# Altium schematic sheet 2_MCU.schdoc.schdoc
size 431 x 309 mm; Symbol: Sheet-Symbol_A4; Device: Sheet-Symbol_A4; @Page Name: MCU; @Create Date: 2023-11-05; @Page Count: 4; @Page No: 4; @Project Name: New Project_2023-10-25_23-03-02; @Schematic Name: Schematic1; @Update Date: 2023-12-01; Company: 嘉立创EDA; Page Size: A4; Version: V1.0; SheetNumber: 4; SheetTotal: 4
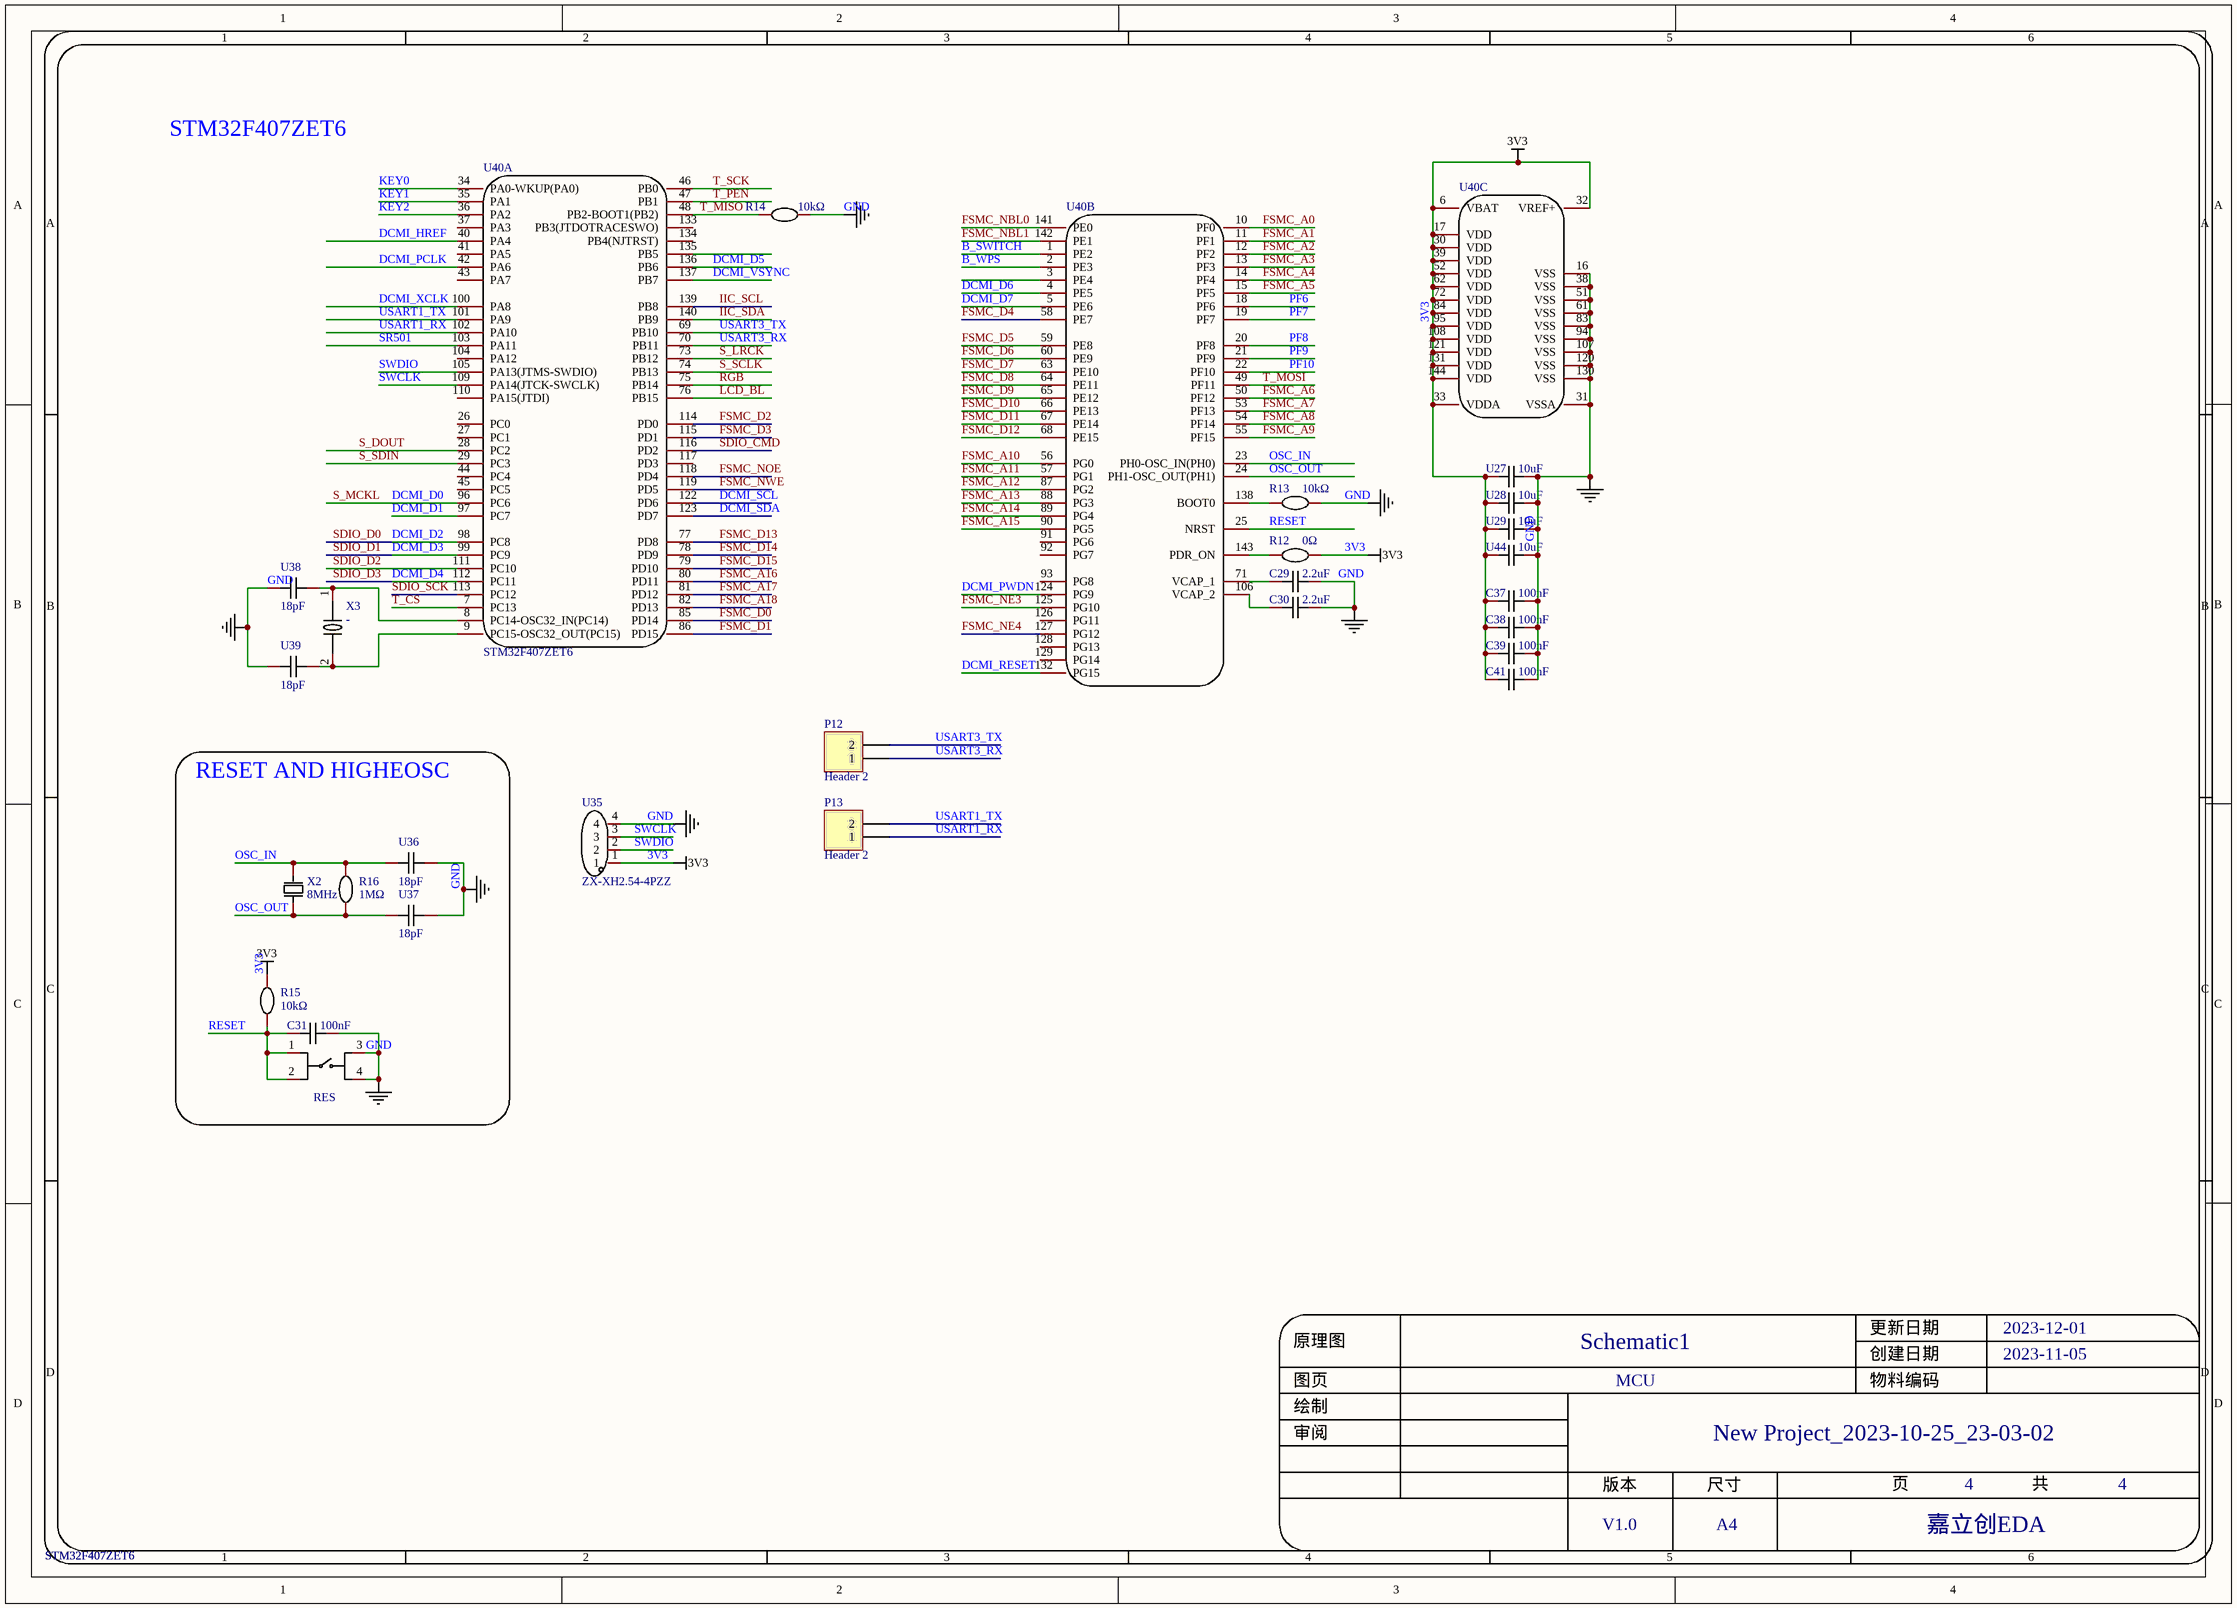
[diagram p0: 2_MCU.schdoc.schdoc]

## Parts
C29  2.2uF  [C0603]
C30  2.2uF  [C0603]
C31  100nF  [C0603]
C37  100nF  [C0603]
C38  100nF  [C0603]
C39  100nF  [C0603]
C41  100nF  [C0603]
P12  Header 2  [HDR1X2]
P13  Header 2  [HDR1X2]
R12  0Ω  [R0603]
R13  10kΩ  [R0603]
R14  10kΩ  [R0603]
R15  10kΩ  [R0603]
R16  1MΩ  [R0603]
RES  K2-6639SP-C4SC-04  [KEY-SMD_4P-L6.0-W6.0-P3.90-LS10.0]  (value not drawn)
U27  10uF  [C0603]
U28  10uF  [C0603]
U29  10uF  [C0603]
U35  ZX-XH2.54-4PZZ  [CONN-TH_4P-P2.50_4PIN]
U36  18pF  [C0603]
U37  18pF  [C0603]
U38  18pF  [C0603]
U39  18pF  [C0603]
U40  STM32F407ZET6  [LQFP-144_L20.0-W20.0-P0.50-LS22.0-BL]  (parts A,B,C of 3)
U44  10uF  [C0603]
X2  8MHz  [OSC-SMD_L5.0-W3.2]
X3  -  [OSC-SMD_2P-L1.6-W1.0]

## Blocks framed on the sheet
RESET AND HIGHEOSC: C31 R15 R16 RES U36 U37 X2

## Nets
3V3: C37.1 C38.1 C39.1 C41.1 R12.2 R15.2 U27.1 U28.1 U29.1 U35.1 U40.6(VBAT) U40.17(VDD) U40.30(VDD) U40.32(VREF+) U40.33(VDDA) U40.39(VDD) U40.52(VDD) U40.62(VDD) U40.72(VDD) U40.84(VDD) U40.95(VDD) U40.108(VDD) U40.121(VDD) U40.131(VDD) U40.144(VDD) U44.1
GND: C29.2 C30.2 C31.2 C37.2 C38.2 C39.2 C41.2 R13.2 R14.2 RES.3 RES.4 U27.2 U28.2 U29.2 U35.4 U36.2 U37.2 U38.1 U39.1 U40.16(VSS) U40.31(VSSA) U40.38(VSS) U40.51(VSS) U40.61(VSS) U40.83(VSS) U40.94(VSS) U40.107(VSS) U40.120(VSS) U40.130(VSS) U44.2
B_SWITCH: U40.1(PE2)
B_WPS: U40.2(PE3)
DCMI_D0: U40.96(PC6)  [also labelled S_MCKL]
DCMI_D1: U40.97(PC7)
DCMI_D2: U40.98(PC8)  [also labelled SDIO_D0]
DCMI_D3: U40.99(PC9)  [also labelled SDIO_D1]
DCMI_D4: U40.112(PC11)  [also labelled SDIO_D3]
DCMI_D5: U40.136(PB6)
DCMI_D6: U40.4(PE5)
DCMI_D7: U40.5(PE6)
DCMI_HREF: U40.40(PA4)
DCMI_PCLK: U40.42(PA6)
DCMI_PWDN: U40.124(PG9)
DCMI_RESET: U40.132(PG15)
DCMI_SCL: U40.122(PD6)
DCMI_SDA: U40.123(PD7)
DCMI_VSYNC: U40.137(PB7)
DCMI_XCLK: U40.100(PA8)
FSMC_A0: U40.10(PF0)
FSMC_A1: U40.11(PF1)
FSMC_A2: U40.12(PF2)
FSMC_A3: U40.13(PF3)
FSMC_A4: U40.14(PF4)
FSMC_A5: U40.15(PF5)
FSMC_A6: U40.50(PF12)
FSMC_A7: U40.53(PF13)
FSMC_A8: U40.54(PF14)
FSMC_A9: U40.55(PF15)
FSMC_A10: U40.56(PG0)
FSMC_A11: U40.57(PG1)
FSMC_A12: U40.87(PG2)
FSMC_A13: U40.88(PG3)
FSMC_A14: U40.89(PG4)
FSMC_A15: U40.90(PG5)
FSMC_A16: U40.80(PD11)
FSMC_A17: U40.81(PD12)
FSMC_A18: U40.82(PD13)
FSMC_D0: U40.85(PD14)
FSMC_D1: U40.86(PD15)
FSMC_D2: U40.114(PD0)
FSMC_D3: U40.115(PD1)
FSMC_D4: U40.58(PE7)
FSMC_D5: U40.59(PE8)
FSMC_D6: U40.60(PE9)
FSMC_D7: U40.63(PE10)
FSMC_D8: U40.64(PE11)
FSMC_D9: U40.65(PE12)
FSMC_D10: U40.66(PE13)
FSMC_D11: U40.67(PE14)
FSMC_D12: U40.68(PE15)
FSMC_D13: U40.77(PD8)
FSMC_D14: U40.78(PD9)
FSMC_D15: U40.79(PD10)
FSMC_NBL0: U40.141(PE0)
FSMC_NBL1: U40.142(PE1)
FSMC_NE3: U40.125(PG10)
FSMC_NE4: U40.127(PG12)
FSMC_NOE: U40.118(PD4)
FSMC_NWE: U40.119(PD5)
IIC_SCL: U40.139(PB8)
IIC_SDA: U40.140(PB9)
KEY0: U40.34(PA0-WKUP(PA0))
KEY1: U40.35(PA1)
KEY2: U40.36(PA2)
LCD_BL: U40.76(PB15)
OSC_IN: R16.2 U36.1 U40.23(PH0-OSC_IN(PH0)) X2.2(OSC2)
OSC_OUT: R16.1 U37.1 U40.24(PH1-OSC_OUT(PH1)) X2.1(OSC1)
PF6: U40.18(PF6)
PF7: U40.19(PF7)
PF8: U40.20(PF8)
PF9: U40.21(PF9)
PF10: U40.22(PF10)
RESET: C31.1 R15.1 RES.1 RES.2 U40.25(NRST)
RGB: U40.75(PB14)
S_DOUT: U40.28(PC2)
S_LRCK: U40.73(PB12)
S_SCLK: U40.74(PB13)
S_SDIN: U40.29(PC3)
SDIO_CMD: U40.116(PD2)
SDIO_D2: U40.111(PC10)
SDIO_SCK: U40.113(PC12)
SR501: U40.103(PA11)
SWCLK: U35.3 U40.109(PA14(JTCK-SWCLK))
SWDIO: U35.2 U40.105(PA13(JTMS-SWDIO))
T_CS: U40.7(PC13)
T_MISO: R14.1 U40.48(PB2-BOOT1(PB2))
T_MOSI: U40.49(PF11)
T_PEN: U40.47(PB1)
T_SCK: U40.46(PB0)
USART1_RX: P13.1 U40.102(PA10)
USART1_TX: P13.2 U40.101(PA9)
USART3_RX: P12.1 U40.70(PB11)
USART3_TX: P12.2 U40.69(PB10)
NetC29_1: C29.1 U40.71(VCAP_1)
NetC30_1: C30.1 U40.106(VCAP_2)
NetR12_1: R12.1 U40.143(PDR_ON)
NetR13_1: R13.1 U40.138(BOOT0)
NetU38_2: U38.2 U40.8(PC14-OSC32_IN(PC14)) X3.1
NetU39_2: U39.2 U40.9(PC15-OSC32_OUT(PC15)) X3.2

Not connected (* = marked no-connect by the designer): U40 3(PE4) 26(PC0) 27(PC1) 37(PA3) 41(PA5) 43(PA7) 44(PC4) 45(PC5) 91(PG6) 92(PG7) 93(PG8) 104(PA12) 110(PA15(JTDI)) 117(PD3) 126(PG11) 128(PG13) 129(PG14) 133(PB3(JTDOTRACESWO)) 134(PB4(NJTRST)) 135(PB5)

## Notes on the sheet
- STM32F407ZET6
- 1
- 2
- 3
- 4
- 5
- 6
- A
- B
- C
- D
- 原理图
- Schematic1
- 创建日期
- 更新日期
- 2023-11-05
- 2023-12-01
- 审阅
- 绘制
- 图页
- MCU
- 物料编码
- New Project_2023-10-25_23-03-02
- 版本
- 尺寸
- 页
- 共
- V1.0
- A4
- 嘉立创EDA

## Library data of the parts
C29 C30 = C1608X6S1A225K080AB: 容值:2.2uF;精度:±10%;额定电压:10V;材质(温度系数):X6S;; Manufacturer: TDK; Add into BOM: yes; Tolerance: ±10%; Voltage Rated: 10V; Temperature Coefficient: X6S; Name: 2.2uF; Symbol: C1608X6S1A225K080AB; Device: C1608X6S1A225K080AB; LCSC Part Name: 2.2uF ±10% 10V; Supplier Part: C3888161; Manufacturer Part: C1608X6S1A225K080AB; Supplier Footprint: 0603; Supplier: LCSC; Convert to PCB: yes; Value: 2.2uF
C31 C37-C39 C41 = CGA3E3X8R1H104M080AE: 容值:100nF;精度:±20%;额定电压:50V;材质(温度系数):X8R;; Manufacturer: TDK; Add into BOM: yes; Tolerance: ±20%; Voltage Rated: 50V; Temperature Coefficient: X8R; Name: 100nF; Symbol: CGA3E3X8R1H104M080AE; Device: CGA3E3X8R1H104M080AE; LCSC Part Name: 100nF ±20% 50V; Supplier Part: C3855738; Manufacturer Part: CGA3E3X8R1H104M080AE; Supplier Footprint: 0603; Supplier: LCSC; Convert to PCB: yes; Value: 100nF
P12 P13 = Header 2: Header, 2-Pin; LatestRevisionDate: 17-Jul-2002; LatestRevisionNote: Re-released for DXP Platform.; Publisher: Altium Limited
R12 = RC0603JR-130RL: 电阻类型:厚膜电阻;阻值:0Ω;精度:-;功率:100mW;; Manufacturer: YAGEO(国巨); Add into BOM: yes; Power(Watts): 100mW; Overload Voltage (Max): 75V; Name: 0Ω; Symbol: RC0603JR-130RL; Device: RC0603JR-130RL; LCSC Part Name: 0Ω 100mW; Supplier Part: C1512169; Manufacturer Part: RC0603JR-130RL; Supplier Footprint: 0603; JLCPCB Part Class: 扩展库; Datasheet: https://atta.szlcsc.com/upload/public/pdf/source/20210615/C1512169_F749B83676031E9170C7C93785487C19.pdf; Supplier: LCSC; Convert to PCB: yes; Type: 厚膜电阻; Value: 0Ω; Tolerance: -; Temperature Coefficient: -; Operating Temperature Range: -55℃~+155℃
R13-R15 = SCR0603J10K: 阻值:10kΩ;精度:±5%;; Manufacturer: VO(翔胜); Add into BOM: yes; Tolerance: ±5%; Name: 10kΩ; Symbol: SCR0603J10K; Device: SCR0603J10K; LCSC Part Name: 10kΩ ±5%; Supplier Part: C3017715; Manufacturer Part: SCR0603J10K; Supplier Footprint: 0603; JLCPCB Part Class: 扩展库; Datasheet: https://atta.szlcsc.com/upload/public/pdf/source/20220513/247AF9639BA21CF93567DC289CCC6A22.pdf; Supplier: LCSC; Convert to PCB: yes; Value: 10kΩ
R16 = CRCW06031M00JNEAC: 电阻类型:厚膜电阻;阻值:1MΩ;精度:±5%;功率:100mW;; Manufacturer: VISHAY(威世); Add into BOM: yes; Tolerance: ±5%; Power(Watts): 100mW; Temperature Coefficient: ±200ppm/℃; Overload Voltage (Max): 75V; Name: 1MΩ; Symbol: CRCW06031M00JNEAC; Device: CRCW06031M00JNEAC; LCSC Part Name: 1MΩ ±5% 100mW; Supplier Part: C1511824; Manufacturer Part: CRCW06031M00JNEAC; Supplier Footprint: 0603; JLCPCB Part Class: 扩展库; Datasheet: https://atta.szlcsc.com/upload/public/pdf/source/20210501/3A8C68602BA6317D7357138250FC3EA2.pdf; Supplier: LCSC; Convert to PCB: yes; Type: 厚膜电阻; Value: 1MΩ; Operating Temperature Range: -55℃~+155℃
RES = K2-6639SP-C4SC-04: 触点电流:50mA;额定电压(DC):12V;绝缘电阻:100MΩ;安装方式:立贴;作用力:250gf@±30gf;机械寿命:1000000;工作温度:-25℃~+85℃;开关长度:6mm;开关宽度:6mm;开关高度:5mm;; Manufacturer: 韩国韩荣; Symbol: K2-6639SP-C4SC-04_C879344; Add into BOM: yes; Contact Current: 50mA; Voltage Rating (DC): 12V; Insulation Resistance: 100MΩ; Mounting Sytle: 立贴; Switch Length: 6mm; Switch Height: 5mm; Name: K2-6639SP-C4SC-04; Device: K2-6639SP-C4SC-04; LCSC Part Name: K2-6639SP-C4SC-04; Supplier Part: C879344; Manufacturer Part: K2-6639SP-C4SC-04; Supplier Footprint: SMD; JLCPCB Part Class: 扩展库; Datasheet: https://atta.szlcsc.com/upload/public/pdf/source/20200721/C707344_FB3B602593668C8FE1542A3F64DDEE0A.pdf; Supplier: LCSC; Convert to PCB: yes; Operating Force: 250gf@±30gf; Mechanical Life: 1000000; Operating Temperature: -25℃~+85℃; Switch Width: 6mm
U27-U29 U44 = C1608JB1C106M080AB: 容值:10uF;精度:±20%;额定电压:16V;材质(温度系数):JB;; Manufacturer: TDK; Add into BOM: yes; Tolerance: ±20%; Voltage Rated: 16V; Temperature Coefficient: JB; Name: 10uF; Symbol: C1608JB1C106M080AB; Device: C1608JB1C106M080AB; LCSC Part Name: 10uF ±20% 16V; Supplier Part: C3866185; Manufacturer Part: C1608JB1C106M080AB; Supplier Footprint: 0603; Supplier: LCSC; Convert to PCB: yes; Value: 10uF
U35 = ZX-XH2.54-4PZZ: 参考系列:XH;间距:2.54mm;插针结构:1x4P;排数:1;每排PIN数:4;行距:-;公母:公型插针;安装方式:直插;额定电流:3A;触头材质:黄铜;触头镀层:锡;工作温度范围:-25℃~+85℃;焊接温度(最大值):260℃;; Manufacturer: Megastar(兆星); Add into BOM: yes; Reference Series: XH; Pitch: 2.54mm; Pins Structure: 1x4P; Number of PINs Per Row: 4; Gender: 公型插针; Current Rating (Max): 3A; Welding Temperature (Max): 260℃; Name: ZX-XH2.54-4PZZ; Symbol: ZX-XH2.54-4PZZ; Device: ZX-XH2.54-4PZZ; LCSC Part Name: 系列:XH 间距:2.54mm 1x4P 直插; Supplier Part: C7429634; Manufacturer Part: ZX-XH2.54-4PZZ; Supplier Footprint: 插件,P=2.54mm; JLCPCB Part Class: 扩展库; Datasheet: https://atta.szlcsc.com/upload/public/pdf/source/20230619/B529A2163E0159A644AB3383D208FB03.pdf; Supplier: LCSC; Convert to PCB: yes; Number of Rows: 1; Row Spacing: -; Mounting Style: 直插; Contact Material: 黄铜; Contact Plating: 锡; Operating Temperature Range: -25℃~+85℃
U36-U39 = C1608CH2A180J080AA: 容值:18pF;精度:±5%;额定电压:100V;材质(温度系数):CH;; Manufacturer: TDK; Add into BOM: yes; Tolerance: ±5%; Voltage Rated: 100V; Temperature Coefficient: CH; Name: 18pF; Symbol: C1608CH2A180J080AA; Device: C1608CH2A180J080AA; LCSC Part Name: 18pF ±5% 100V; Supplier Part: C3847790; Manufacturer Part: C1608CH2A180J080AA; Supplier Footprint: -; JLCPCB Part Class: 扩展库; Supplier: LCSC; Convert to PCB: yes; Value: 18pF
U40 = STM32F407ZET6: CPU内核:ARM Cortex-M4;CPU最大主频:168MHz;工作电压范围:1.8V~3.6V;程序存储容量:512KB;程序存储器类型:FLASH;RAM总容量:192KB;GPIO端口数量:114;; Manufacturer: ST(意法半导体); Add into BOM: yes; CPU Maximum Speed: 168MHz; Program Storage Size: 512KB; Program Memory Type: FLASH; RAM Size: 192KB; GPIO Ports Number: 114; ADC (Bit): 12bit; Universal Serial Bus: 有; tags: STM32; Name: STM32F407ZET6; Symbol: STM32F407ZET6; Device: STM32F407ZET6; LCSC Part Name: STM32F407ZET6; Supplier Part: C36869; Manufacturer Part: STM32F407ZET6; Supplier Footprint: LQFP-144(20x20); JLCPCB Part Class: 扩展库; Datasheet: https://atta.szlcsc.com/upload/public/pdf/source/20160816/1471342957598.pdf; Supplier: LCSC; Convert to PCB: yes; CPU Core: ARM Cortex-M4; Operating Voltage Range: 1.8V~3.6V; EEPROM: -; DAC (Bit): 12bit; PWM (Bit): -; Internal Comparator: -; communication protocol: -; Watchdog: 有; Real-Time Clock: -; Infrared Data Association: 有; Low-Voltage Detect: 有; CCP Capture/Compare: -; LCD Module: 有; Secure Digital Input and Output: -; Direct Memory Access: 有; Internal Oscillator: 有; Operating Temperature Range: -40℃~+85℃; image: http://image.lceda.cn/szlcsc/C36869.jpg
X2 = TAXM8M2QLFCDT1T: 频率:8MHz;频率公差:±30ppm;负载电容:20pF;; Manufacturer: TAE(雅晶鑫); Symbol: SMD-5032_2P 8M 20pf 30ppm; Add into BOM: yes; Crystal Type: 贴片无源晶振; Frequency Tolerance: ±30ppm; Frequency Stability: ±20ppm; Load Capacitance: 20pF; Equivalent Series Resistance (ESR): 80Ω; Name: 8MHz; Device: TAXM8M2QLFCDT1T; LCSC Part Name: 8MHz ±30ppm 20pF; Supplier Part: C122522; Manufacturer Part: TAXM8M2QLFCDT1T; Supplier Footprint: SMD5032-2P; JLCPCB Part Class: 扩展库; Datasheet: https://atta.szlcsc.com/upload/public/pdf/source/20220113/59EE8A0E7B9F67FF1BF3C454890DE4E5.pdf; Supplier: LCSC; Convert to PCB: yes; Value: 8MHz; Operating Temperature: -40℃~+85℃
X3 = TFX-04-32.768K: 频率:-;负载电容:-;; Manufacturer: RIVER(大河); Symbol: TFX-04-32.768K_C515348; Add into BOM: yes; Name: -; Device: TFX-04-32.768K; LCSC Part Name: 时钟晶体 32.768kHz 4PF 20PPM; Supplier Part: C515348; Manufacturer Part: TFX-04-32.768K; Supplier Footprint: SMD1610-2P; JLCPCB Part Class: 扩展库; Datasheet: https://atta.szlcsc.com/upload/public/pdf/source/20200917/C515346_EDFB4A3F7406CD145B2E2A90CB656616.pdf; Supplier: LCSC; Convert to PCB: yes; Crystal Type: -; Value: -; Load Capacitance: -; Operating Temperature: -